# Altium schematic sheet hcpl0630.SchDoc
size A4
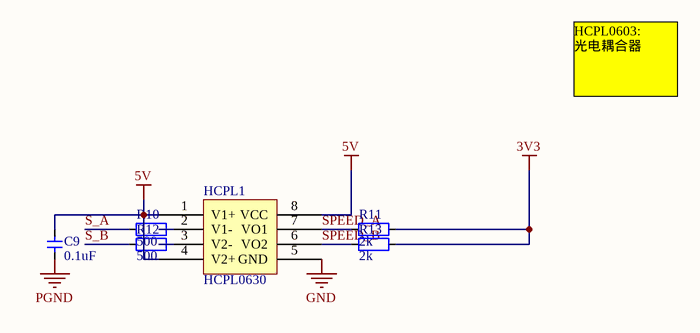
[diagram p0: hcpl0630.SchDoc]

## Parts
C9  value 0.1uF  [CAP_0603]  (hidden comment: Cap_0603)
HCPL1  HCPL0630  [SOP_E150_8]
R10  value 500  [RES_0603]  (hidden comment: Res_0603)
R11  value 2k  [RES_0603]  (hidden comment: Res_0603)
R12  value 500  [RES_0603]  (hidden comment: Res_0603)
R13  value 2k  [RES_0603]  (hidden comment: Res_0603)

## Nets
3V3: R11.1 R13.1
5V: C9.2 HCPL1.1(V1+) HCPL1.4(V2+) HCPL1.8(VCC)
GND: HCPL1.5(GND)
PGND: C9.1
S_A: R10.2
S_B: R12.2
SPEED_A: HCPL1.7(VO1) R11.2
SPEED_B: HCPL1.6(VO2) R13.2
NetHCPL1_2: HCPL1.2(V1-) R10.1
NetHCPL1_3: HCPL1.3(V2-) R12.1

## Notes on the sheet
- HCPL0603:
  光电耦合器

## Library data of the parts
C9 = Cap_0603: Capacitor
R10-R13 = Res_0603: Resistor